# Altium project QCopterMV.PrjPCB
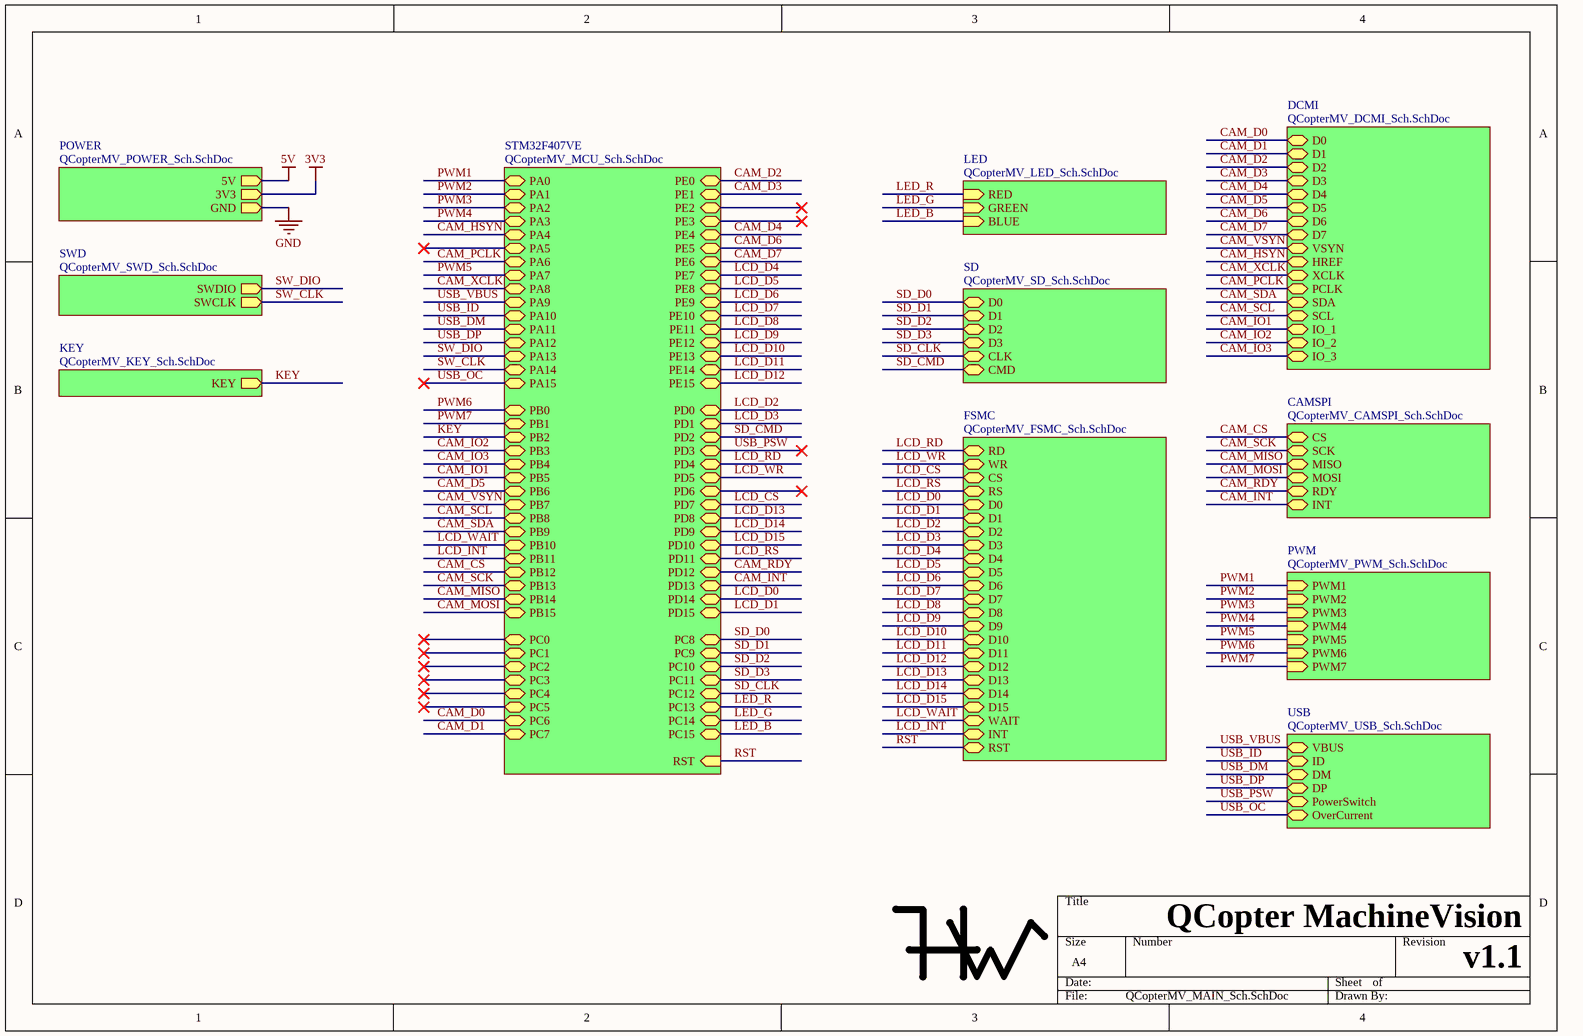
[diagram p0: QCopterMV_MAIN_Sch.SchDoc]
7 sheets, 22 parts. Net scope: hierarchical (ports join the sheet entries above them; power ports are global).
Board file: QCopterMV__Pcb.PcbDoc
Sheets:
  QCopterMV_MAIN_Sch.SchDoc
    DCMI = QCopterMV_DCMI_Sch.SchDoc
    POWER = QCopterMV_POWER_Sch.SchDoc
    SWD = QCopterMV_SWD_Sch.SchDoc
    KEY = QCopterMV_KEY_Sch.SchDoc
    FSMC = QCopterMV_FSMC_Sch.SchDoc
    CAMSPI = QCopterMV_CAMSPI_Sch.SchDoc

## Sheet QCopterMV_MAIN_Sch.SchDoc
size A4

### Parts
Mark1  Mark  [HW_Mark]  (value not drawn)

### Sub-sheets
CAMSPI = QCopterMV_CAMSPI_Sch.SchDoc: MISO, CS, MOSI, SCK, RDY, INT
DCMI = QCopterMV_DCMI_Sch.SchDoc: D1, D0, D2, D3, D4, VSYN, HREF, PCLK, XCLK, SCL, SDA, D5, D6, D7, IO_1, IO_2, IO_3
FSMC = QCopterMV_FSMC_Sch.SchDoc: RS, CS, WR, RD, RST, D0, D1, D2, D3, D4, D5, D6, D7, D8, D9, D10, D11, D12, D13, D14, D15, WAIT, INT
KEY = QCopterMV_KEY_Sch.SchDoc: KEY (out)
LED = QCopterMV_LED_Sch.SchDoc (file not in this document): RED (in), GREEN (in), BLUE (in)
POWER = QCopterMV_POWER_Sch.SchDoc: 3V3 (out), 5V (out), GND (out)
PWM = QCopterMV_PWM_Sch.SchDoc (file not in this document): PWM7 (in), PWM1 (in), PWM2 (in), PWM3 (in), PWM4 (in), PWM5 (in), PWM6 (in)
SD = QCopterMV_SD_Sch.SchDoc (file not in this document): D0, CLK, CMD, D1, D2, D3
STM32F407VE = QCopterMV_MCU_Sch.SchDoc (file not in this document): PA0, PA1, PA2, PA3, PA4, PA5, PA6, PA7, PA8, PA9, PA10, PA11, PA12, PA13, PA14, PA15, PB0, PB1, PB2, PB3, PB4, PB5, PB6, PB7, PB8, PB9, PB10, PB11, PB12, PB13, PB14, PB15, PC0, PC1, PC2, PC3, PC4, PC5, PC6, PC7, PC8, PC9, PC10, PC11, PC12, PC13, PC14, PC15, PD0, PD1, PD2, PD3, PD4, PD5, PD6, PD7, PD8, PD9, PD10, PD11, PD12, PD13, PD14, PD15, RST (in), PE0, PE1, PE2, PE3, PE4, PE5, PE6, PE7, PE8, PE9, PE10, PE11, PE12, PE13, PE14, PE15
SWD = QCopterMV_SWD_Sch.SchDoc: SWDIO (out), SWCLK (out)
USB = QCopterMV_USB_Sch.SchDoc (file not in this document): VBUS, ID, DM, DP, PowerSwitch, OverCurrent

### Nets
CAM_CS: sheet STM32F407VE/PB12, sheet CAMSPI/CS
CAM_D0: sheet DCMI/D0, sheet STM32F407VE/PC6
CAM_D1: sheet DCMI/D1, sheet STM32F407VE/PC7
CAM_D2: sheet DCMI/D2, sheet STM32F407VE/PE0
CAM_D3: sheet DCMI/D3, sheet STM32F407VE/PE1
CAM_D4: sheet DCMI/D4, sheet STM32F407VE/PE4
CAM_D5: sheet DCMI/D5, sheet STM32F407VE/PB6
CAM_D6: sheet DCMI/D6, sheet STM32F407VE/PE5
CAM_D7: sheet DCMI/D7, sheet STM32F407VE/PE6
CAM_HSYN: sheet DCMI/HREF, sheet STM32F407VE/PA4
CAM_INT: sheet STM32F407VE/PD13, sheet CAMSPI/INT
CAM_IO1: sheet DCMI/IO_1, sheet STM32F407VE/PB5
CAM_IO2: sheet DCMI/IO_2, sheet STM32F407VE/PB3
CAM_IO3: sheet DCMI/IO_3, sheet STM32F407VE/PB4
CAM_MISO: sheet STM32F407VE/PB14, sheet CAMSPI/MISO
CAM_MOSI: sheet STM32F407VE/PB15, sheet CAMSPI/MOSI
CAM_PCLK: sheet DCMI/PCLK, sheet STM32F407VE/PA6
CAM_RDY: sheet STM32F407VE/PD12, sheet CAMSPI/RDY
CAM_SCK: sheet STM32F407VE/PB13, sheet CAMSPI/SCK
CAM_SCL: sheet DCMI/SCL, sheet STM32F407VE/PB8
CAM_SDA: sheet DCMI/SDA, sheet STM32F407VE/PB9
CAM_VSYN: sheet DCMI/VSYN, sheet STM32F407VE/PB7
CAM_XCLK: sheet DCMI/XCLK, sheet STM32F407VE/PA8
KEY: sheet KEY/KEY, sheet STM32F407VE/PB2
LCD_CS: sheet STM32F407VE/PD7, sheet FSMC/CS
LCD_D0: sheet STM32F407VE/PD14, sheet FSMC/D0
LCD_D1: sheet STM32F407VE/PD15, sheet FSMC/D1
LCD_D2: sheet STM32F407VE/PD0, sheet FSMC/D2
LCD_D3: sheet STM32F407VE/PD1, sheet FSMC/D3
LCD_D4: sheet STM32F407VE/PE7, sheet FSMC/D4
LCD_D5: sheet STM32F407VE/PE8, sheet FSMC/D5
LCD_D6: sheet STM32F407VE/PE9, sheet FSMC/D6
LCD_D7: sheet STM32F407VE/PE10, sheet FSMC/D7
LCD_D8: sheet STM32F407VE/PE11, sheet FSMC/D8
LCD_D9: sheet STM32F407VE/PE12, sheet FSMC/D9
LCD_D10: sheet STM32F407VE/PE13, sheet FSMC/D10
LCD_D11: sheet STM32F407VE/PE14, sheet FSMC/D11
LCD_D12: sheet STM32F407VE/PE15, sheet FSMC/D12
LCD_D13: sheet STM32F407VE/PD8, sheet FSMC/D13
LCD_D14: sheet STM32F407VE/PD9, sheet FSMC/D14
LCD_D15: sheet STM32F407VE/PD10, sheet FSMC/D15
LCD_INT: sheet STM32F407VE/PB11, sheet FSMC/INT
LCD_RD: sheet STM32F407VE/PD4, sheet FSMC/RD
LCD_RS: sheet STM32F407VE/PD11, sheet FSMC/RS
LCD_WAIT: sheet STM32F407VE/PB10, sheet FSMC/WAIT
LCD_WR: sheet STM32F407VE/PD5, sheet FSMC/WR
LED_B: sheet LED/BLUE, sheet STM32F407VE/PC15
LED_G: sheet LED/GREEN, sheet STM32F407VE/PC14
LED_R: sheet LED/RED, sheet STM32F407VE/PC13
PWM1: sheet PWM/PWM1, sheet STM32F407VE/PA0
PWM2: sheet PWM/PWM2, sheet STM32F407VE/PA1
PWM3: sheet PWM/PWM3, sheet STM32F407VE/PA2
PWM4: sheet PWM/PWM4, sheet STM32F407VE/PA3
PWM5: sheet PWM/PWM5, sheet STM32F407VE/PA7
PWM6: sheet PWM/PWM6, sheet STM32F407VE/PB0
PWM7: sheet PWM/PWM7, sheet STM32F407VE/PB1
RST: sheet STM32F407VE/RST, sheet FSMC/RST
SD_CLK: sheet SD/CLK, sheet STM32F407VE/PC12
SD_CMD: sheet SD/CMD, sheet STM32F407VE/PD2
SD_D0: sheet SD/D0, sheet STM32F407VE/PC8
SD_D1: sheet SD/D1, sheet STM32F407VE/PC9
SD_D2: sheet SD/D2, sheet STM32F407VE/PC10
SD_D3: sheet SD/D3, sheet STM32F407VE/PC11
SW_CLK: sheet SWD/SWCLK, sheet STM32F407VE/PA14
SW_DIO: sheet SWD/SWDIO, sheet STM32F407VE/PA13
USB_DM: sheet STM32F407VE/PA11, sheet USB/DM
USB_DP: sheet STM32F407VE/PA12, sheet USB/DP
USB_ID: sheet STM32F407VE/PA10, sheet USB/ID
USB_OC: sheet STM32F407VE/PA15, sheet USB/OverCurrent
USB_PSW: sheet STM32F407VE/PD3, sheet USB/PowerSwitch
USB_VBUS: sheet STM32F407VE/PA9, sheet USB/VBUS

### Notes on the sheet
- QCopter MachineVision
- v1.1

### Library data of the parts
Mark1 = HW

## Sheet QCopterMV_DCMI_Sch.SchDoc
size A4
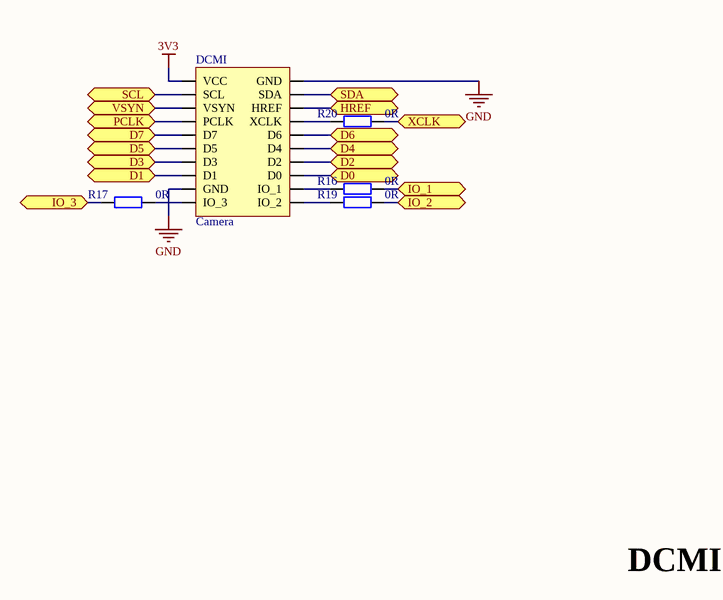
[diagram p1: QCopterMV_DCMI_Sch.SchDoc]

### Parts
DCMI  Camera  [CAMERA]
R16  value 0R  [RES_0603]  (hidden comment: Res_0603)
R17  value 0R  [RES_0603]  (hidden comment: Res_0603)
R19  value 0R  [RES_0603]  (hidden comment: Res_0603)
R20  value 0R  [RES_0603]  (hidden comment: Res_0603)

### Ports
D0, D1, D2, D3, D4, D5, D6, D7, HREF, IO_1, IO_2, IO_3, PCLK, SCL, SDA, VSYN, XCLK

### Nets
3V3: DCMI.1(VCC)
GND: DCMI.2(GND) DCMI.17(GND)
CAM_D0: DCMI.16(D0) ; port D0
CAM_D1: DCMI.15(D1) ; port D1
CAM_D2: DCMI.14(D2) ; port D2
CAM_D3: DCMI.13(D3) ; port D3
CAM_D4: DCMI.12(D4) ; port D4
CAM_D5: DCMI.11(D5) ; port D5
CAM_D6: DCMI.10(D6) ; port D6
CAM_D7: DCMI.9(D7) ; port D7
CAM_HSYN: DCMI.6(HREF) ; port HREF
CAM_IO1: R16.2 ; port IO_1
CAM_IO2: R19.2 ; port IO_2
CAM_IO3: R17.1 ; port IO_3
CAM_PCLK: DCMI.7(PCLK) ; port PCLK
CAM_SCL: DCMI.3(SCL) ; port SCL
CAM_SDA: DCMI.4(SDA) ; port SDA
CAM_VSYN: DCMI.5(VSYN) ; port VSYN
CAM_XCLK: R20.2 ; port XCLK
NetDCMI_8: DCMI.8(XCLK) R20.1
NetDCMI_18: DCMI.18(IO_1) R16.1
NetDCMI_19: DCMI.19(IO_3) R17.2
NetDCMI_20: DCMI.20(IO_2) R19.1

### Notes on the sheet
- DCMI

### Library data of the parts
DCMI = Camera: Module
R16 R17 R19 R20 = Res_0603: Resistor

## Sheet QCopterMV_POWER_Sch.SchDoc
size A4
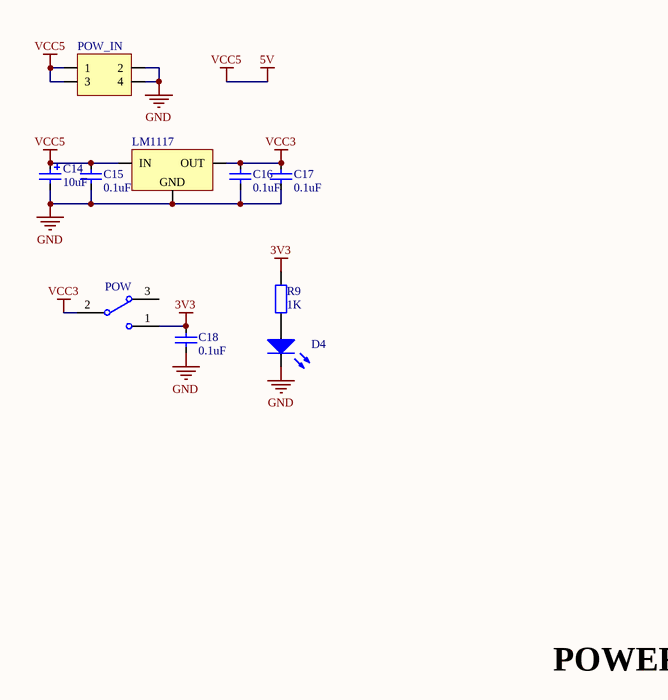
[diagram p2: QCopterMV_POWER_Sch.SchDoc]

### Parts
C14  value 10uF  [CAP_TAN_B1210]  (hidden comment: Cap_Tan_1210)
C15  value 0.1uF  [CAP_0603]  (hidden comment: Cap_0603)
C16  value 0.1uF  [CAP_0603]  (hidden comment: Cap_0603)
C17  value 0.1uF  [CAP_0603]  (hidden comment: Cap_0603)
C18  value 0.1uF  [CAP_0603]  (hidden comment: Cap_0603)
D4  LED_0603_BLUE  [LED_0603_BLUE]  (value not drawn)
LM1  LM1117  [SOT223]
POW  SW-SPDT  [SW_T]  (value not drawn)
POW_IN  HDR2X2_90_2.54  [HDR2X2_90_2.54]  (value not drawn)
R9  value 1K  [RES_0603]  (hidden comment: Res_0603)

### Nets
3V3: C18.2 POW.1 R9.2
5V: C14.1 C15.2 LM1.3(IN) POW_IN.1 POW_IN.3  [also labelled VCC5]
GND: C14.2 C15.1 C16.1 C17.1 C18.1 D4.2(K) LM1.1(GND) POW_IN.2 POW_IN.4
VCC3: C16.2 C17.2 LM1.2(OUT) POW.2
NetD4_1: D4.1(A) R9.1

Not connected (* = marked no-connect by the designer): POW 3

### Notes on the sheet
- POWER

### Library data of the parts
C14 = Cap_Tan_1210: Capacitor
C15-C18 = Cap_0603: Capacitor
D4 = LED_0603_BLUE: LED
LM1 = LM1117: Power
POW = SW-SPDT_1: SPDT Subminiature Toggle Switch, Right Angle Mounting, Vertical Actuation; Published: 24-Mar-1999; LatestRevisionDate: 17-Dec-2003; LatestRevisionNote: Schematic revised, PCB Footprint replaced.; DatasheetVersion: 05-Dec-2000; PackageReference: TL36WW15050; Publisher: Altium Limited; PackageDescription: Switch; 4 Leads; ComponentLink1Description: Manufacturer Link; ComponentLink1URL: http://www.apem.com
POW_IN = HDR2X2_90_2.54: Header
R9 = Res_0603: Resistor

## Sheet QCopterMV_SWD_Sch.SchDoc
size A4
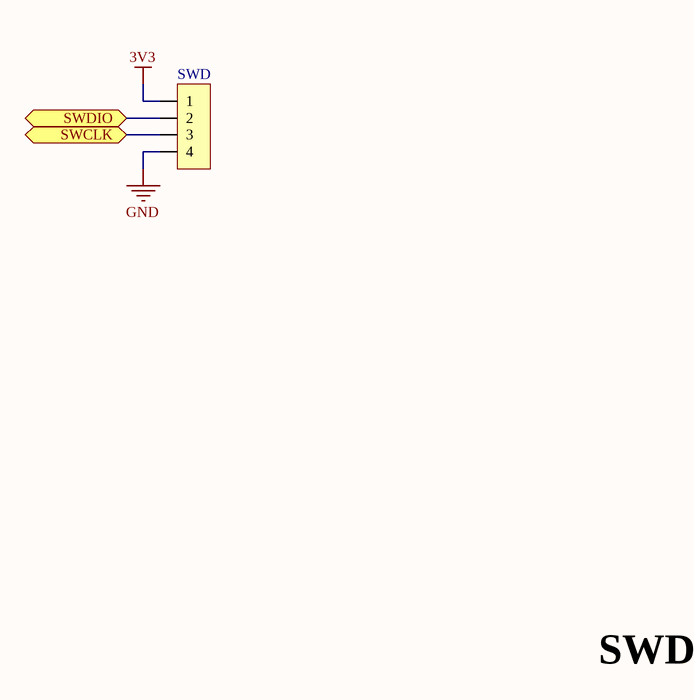
[diagram p3: QCopterMV_SWD_Sch.SchDoc]

### Parts
SWD  HDR1X4_90F_2.54  [HDR1X4_90F_2.54]  (value not drawn)

### Ports
SWCLK, SWDIO

### Nets
3V3: SWD.1
GND: SWD.4
SW_CLK: SWD.3 ; port SWCLK
SW_DIO: SWD.2 ; port SWDIO

### Notes on the sheet
- SWD

### Library data of the parts
SWD = HDR1X4_90F_2.54: Header

## Sheet QCopterMV_KEY_Sch.SchDoc
size A4
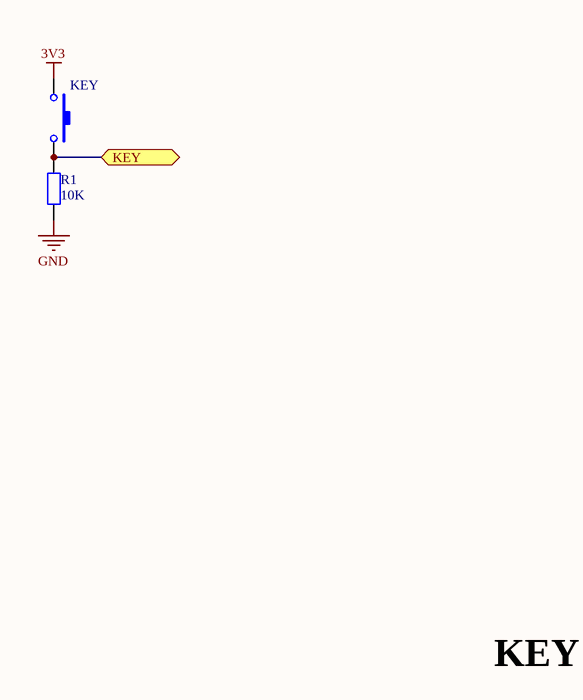
[diagram p4: QCopterMV_KEY_Sch.SchDoc]

### Parts
KEY  SW-PB_1  [BT_90_T]  (value not drawn)
R1  value 10K  [RES_0603]  (hidden comment: Res_0603)

### Ports
KEY

### Nets
3V3: KEY.1
GND: R1.1
KEY: KEY.2 R1.2 ; port KEY

### Notes on the sheet
- KEY

### Library data of the parts
KEY = SW-PB_1: Switch; Published: 24-Mar-1999; LatestRevisionDate: 17-Jul-2002; LatestRevisionNote: Re-released for DXP Platform.; PackageReference: SPST-2; Publisher: Altium Limited; PackageDescription: Switch; 2 Leads
R1 = Res_0603: Resistor

## Sheet QCopterMV_FSMC_Sch.SchDoc
size A4; DocumentNumber: 10; SheetNumber: 10; SheetTotal: 10
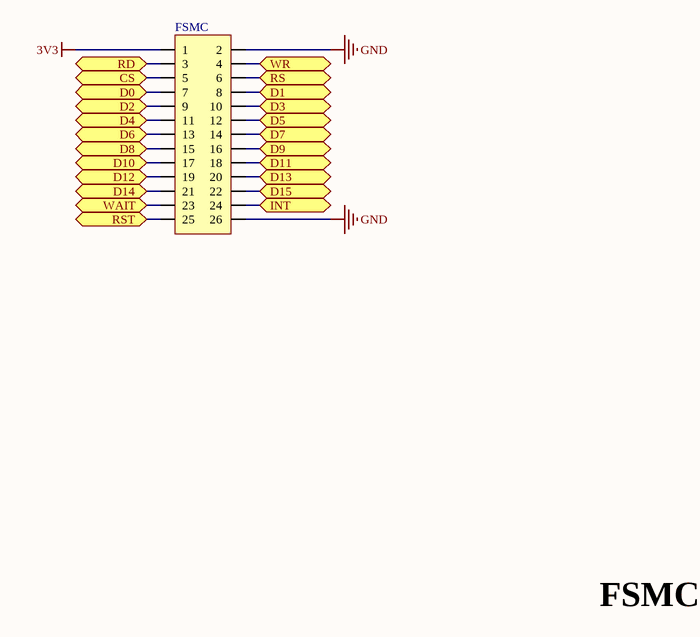
[diagram p5: QCopterMV_FSMC_Sch.SchDoc]

### Parts
FSMC  HDR2X13_180FTB_2.54  [HDR2X13_180FTB_2.54]  (value not drawn)

### Ports
CS, D0, D1, D2, D3, D4, D5, D6, D7, D8, D9, D10, D11, D12, D13, D14, D15, INT, RD, RS, RST, WAIT, WR

### Nets
3V3: FSMC.1
GND: FSMC.2 FSMC.26
LCD_CS: FSMC.5 ; port CS
LCD_D0: FSMC.7 ; port D0
LCD_D1: FSMC.8 ; port D1
LCD_D2: FSMC.9 ; port D2
LCD_D3: FSMC.10 ; port D3
LCD_D4: FSMC.11 ; port D4
LCD_D5: FSMC.12 ; port D5
LCD_D6: FSMC.13 ; port D6
LCD_D7: FSMC.14 ; port D7
LCD_D8: FSMC.15 ; port D8
LCD_D9: FSMC.16 ; port D9
LCD_D10: FSMC.17 ; port D10
LCD_D11: FSMC.18 ; port D11
LCD_D12: FSMC.19 ; port D12
LCD_D13: FSMC.20 ; port D13
LCD_D14: FSMC.21 ; port D14
LCD_D15: FSMC.22 ; port D15
LCD_INT: FSMC.24 ; port INT
LCD_RD: FSMC.3 ; port RD
LCD_RS: FSMC.6 ; port RS
LCD_WAIT: FSMC.23 ; port WAIT
LCD_WR: FSMC.4 ; port WR
RST: FSMC.25 ; port RST

### Notes on the sheet
- FSMC

### Library data of the parts
FSMC = HDR2X13_180FTB_2.54: Header

## Sheet QCopterMV_CAMSPI_Sch.SchDoc
size A4
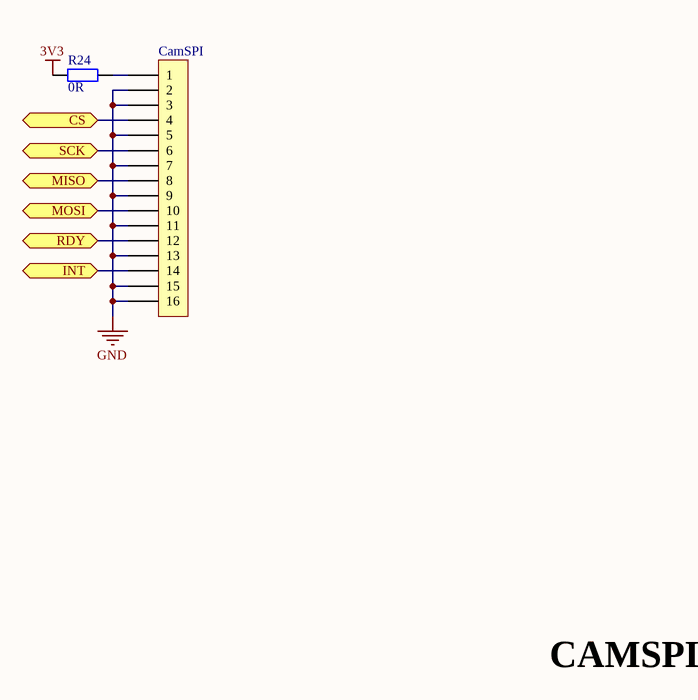
[diagram p6: QCopterMV_CAMSPI_Sch.SchDoc]

### Parts
CamSPI  FFC_0.5_16  [FFC_0.5_16]  (value not drawn)
R24  value 0R  [RES_0603]  (hidden comment: Res_0603)

### Ports
CS, INT, MISO, MOSI, RDY, SCK

### Nets
3V3: R24.1
GND: CamSPI.2 CamSPI.3 CamSPI.5 CamSPI.7 CamSPI.9 CamSPI.11 CamSPI.13 CamSPI.15 CamSPI.16
CAM_CS: CamSPI.4 ; port CS
CAM_INT: CamSPI.14 ; port INT
CAM_MISO: CamSPI.8 ; port MISO
CAM_MOSI: CamSPI.10 ; port MOSI
CAM_RDY: CamSPI.12 ; port RDY
CAM_SCK: CamSPI.6 ; port SCK
NetCamSPI_1: CamSPI.1 R24.2

### Notes on the sheet
- CAMSPI

### Library data of the parts
CamSPI = FFC_0.5_16: FFC
R24 = Res_0603: Resistor

## Nets that join several sheets
3V3: QCopterMV_DCMI_Sch (DCMI.1), QCopterMV_POWER_Sch (C18.2 POW.1 R9.2), QCopterMV_SWD_Sch (SWD.1), QCopterMV_KEY_Sch (KEY.1), QCopterMV_FSMC_Sch (FSMC.1), QCopterMV_CAMSPI_Sch (R24.1)
GND: QCopterMV_DCMI_Sch (DCMI.2 DCMI.17), QCopterMV_POWER_Sch (9 pins), QCopterMV_SWD_Sch (SWD.4), QCopterMV_KEY_Sch (R1.1), QCopterMV_FSMC_Sch (FSMC.2 FSMC.26), QCopterMV_CAMSPI_Sch (9 pins)